# EAGLE design prototype (EAGLE 5.11)
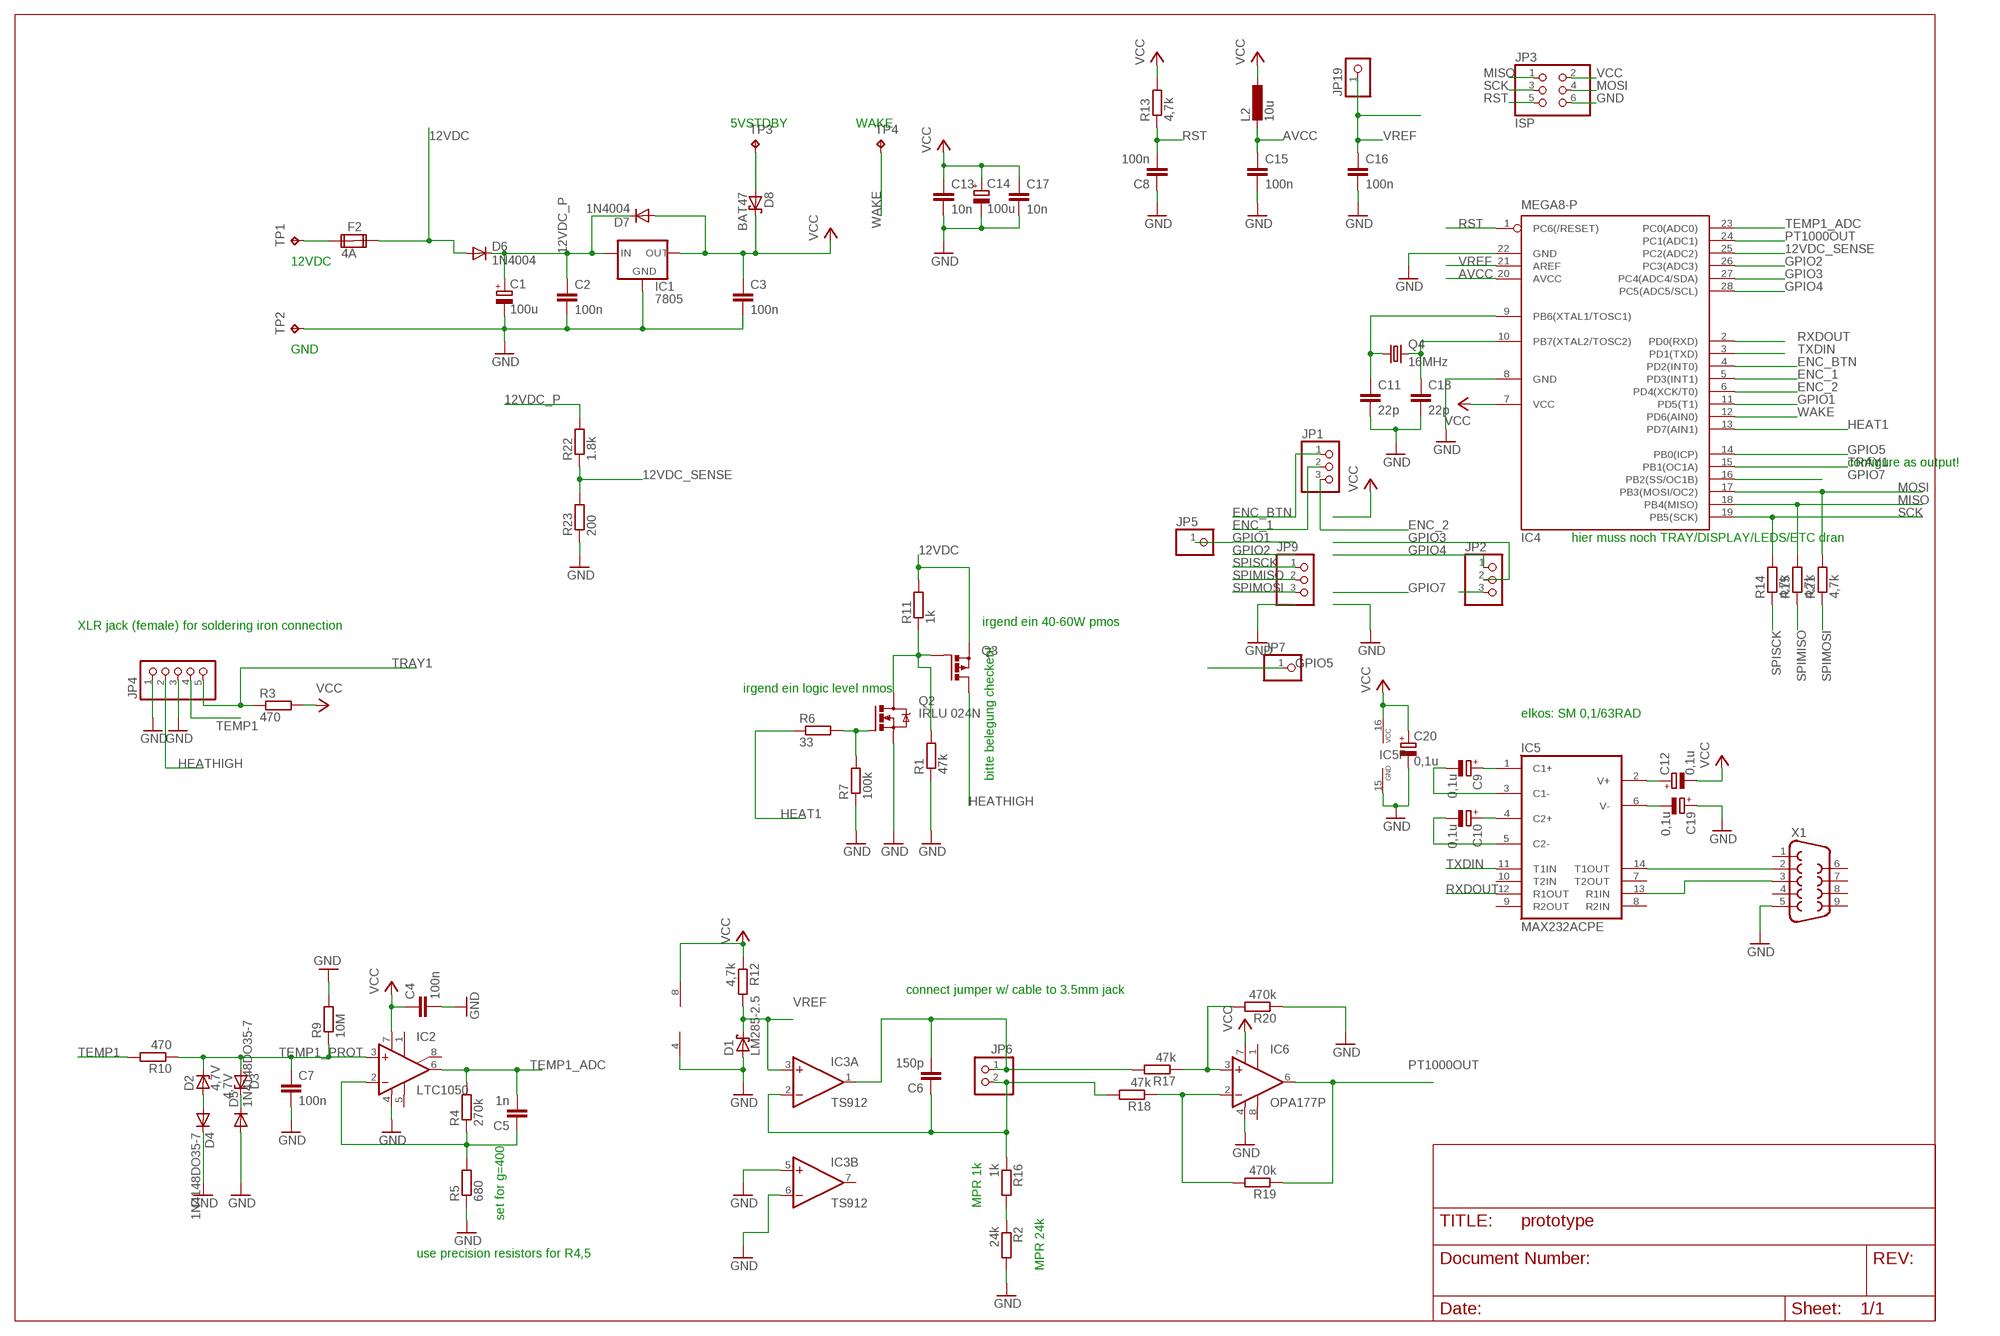
[diagram p0: schematic, sheet 1]

## Parts
C1  100u  CPOL-EUE3.5-8  [E3,5-8]
C2  100n  C-EU050-030X075  [C050-030X075]
C3  100n  C-EU050-030X075  [C050-030X075]
C4  100n  C-EU050-030X075  [C050-030X075]
C5  1n  C-EU050-030X075  [C050-030X075]
C6  150p  C-EU050-025X075  [C050-025X075]
C7  100n  C-EU050-030X075  [C050-030X075]
C8  100n  C-EU050-030X075  [C050-030X075]
C9  0,1u  CPOL-EUE1.8-4  [E1,8-4]
C10  0,1u  CPOL-EUE1.8-4  [E1,8-4]
C11  22p  C-EU025-025X050  [C025-025X050]
C12  0,1u  CPOL-EUE1.8-4  [E1,8-4]
C13  10n  C-EU050-030X075  [C050-030X075]
C14  100u  CPOL-EUE3.5-8  [E3,5-8]
C15  100n  C-EU050-030X075  [C050-030X075]
C16  100n  C-EU050-030X075  [C050-030X075]
C17  10n  C-EU050-030X075  [C050-030X075]
C18  22p  C-EU025-025X050  [C025-025X050]
C19  0,1u  CPOL-EUE1.8-4  [E1,8-4]
C20  0,1u  CPOL-EUE1.8-4  [E1,8-4]
D1  LM285-2.5  SCHOTTKY-DIODETO92H  [TO92H]
D2  4,7V  ZENER-DIODEDO34-7  [DO34Z7]
D3  4,7V  ZENER-DIODEDO34-7  [DO34Z7]
D4  1N4148DO35-7  [DO35-7]
D5  1N4148DO35-7  [DO35-7]
D6  1N4004  [DO41-10]
D7  1N4004  [DO41-10]
D8  BAT47  BAT49  [DO41-10]
F2  4A  FUSE2P  [FUSE1]
IC1  7805  78XXS  [78XXS]
IC2  LTC1050  LM101N  [DIL08]
IC3  TS912  LM358N  [DIL08]
IC4  MEGA8-P  [DIL28-3]
IC5  MAX232ACPE  MAX232  [DIL16]
IC6  OPA177P  [DIL08]
JP1  PINHD-1X3  [1X03]
JP2  PINHD-1X3  [1X03]
JP3  ISP  PINHD-2X3  [2X03]
JP4  PINHD-1X5  [1X05]
JP5  PINHD-1X1  [1X01]
JP6  PINHD-1X2  [1X02]
JP7  PINHD-1X1  [1X01]
JP9  PINHD-1X3  [1X03]
JP19  PINHD1-NOPLACE  [1X1-NOPLACE]
L2  10u  L-EU0207/12  [0207/12]
Q2  IRLU 024N  IRLZ44Z  [TO220BH]
Q3  PMOSFET_PTO220BH  [TO220BH]
Q4  16MHz  CRYSTALHC49S  [HC49/S]
R1  47k  R-EU_0309/10  [0309/10]
R2  24k  R-EU_0309/10  [0309/10]
R3  470  R-EU_0207/7  [0207/7]
R4  270k  R-EU_0309/10  [0309/10]
R5  680  R-EU_0309/10  [0309/10]
R6  33  R-EU_0309/10  [0309/10]
R7  100k  R-EU_0309/10  [0309/10]
R9  10M  R-EU_0309/10  [0309/10]
R10  470  R-EU_0309/10  [0309/10]
R11  1k  R-EU_0309/10  [0309/10]
R12  4,7k  R-EU_0309/10  [0309/10]
R13  4,7k  R-EU_0309/10  [0309/10]
R14  4,7k  R-EU_0309/10  [0309/10]
R15  4,7k  R-EU_0309/10  [0309/10]
R16  1k  R-EU_0309/10  [0309/10]
R17  47k  R-EU_0309/10  [0309/10]
R18  47k  R-EU_0309/10  [0309/10]
R19  470k  R-EU_0309/10  [0309/10]
R20  470k  R-EU_0309/10  [0309/10]
R21  4,7k  R-EU_0309/10  [0309/10]
R22  1.8k  R-EU_0309/10  [0309/10]
R23  200  R-EU_0309/10  [0309/10]
TP1  TPPAD1-13Y  [P1-13Y]
TP2  TPPAD1-13Y  [P1-13Y]
TP3  TPPAD1-13Y  [P1-13Y]
TP4  TPPAD1-13Y  [P1-13Y]
X1  F09HP  [F09HP]

## Nets
12VDC: D6.A F2.2A Q3.S R11.2
12VDC_P: C1.+ C2.1 D6.C D7.C IC1.IN R22.2
12VDC_SENSE: IC4.25(PC2(ADC2)) R22.1 R23.2
AVCC: C15.1 IC4.20(AVCC) L2.2
ENC_1: IC4.5(PD3(INT1)) JP1.2
ENC_2: IC4.6(PD4(XCK/T0)) JP1.3
ENC_BTN: IC4.4(PD2(INT0)) JP1.1
GND: C1.- C2.2 C3.2 C4.2 C7.2 C8.1 C11.2 C13.2 C14.- C15.2 C16.2 C17.2 C18.2 C19.+ C20.- D1.1(A) D4.C D5.A IC1.GND IC2.4(V-) IC3.4(P:V-) IC3.5(B:+IN) IC3.6(B:-IN) IC4.8(GND) IC4.22(GND) IC5.15(GND) IC6.4(V-) JP3.6 JP4.1 JP4.3 Q2.S R1.1 R2.2 R5.1 R7.1 R9.2 R20.1 R23.1 TP2.TP X1.5
GPIO1: IC4.11(PD5(T1)) JP5.1
GPIO2: IC4.26(PC3(ADC3)) JP2.3
GPIO3: IC4.27(PC4(ADC4/SDA)) JP2.2
GPIO4: IC4.28(PC5(ADC5/SCL)) JP2.1
GPIO5: IC4.14(PB0(ICP)) JP7.1
GPIO7: IC4.16(PB2(SS/OC1B))
HEAT1: IC4.13(PD7(AIN1)) R6.1
HEATHIGH: JP4.2 Q3.D
MISO: IC4.18(PB4(MISO)) JP3.1 R15.2
MOSI: IC4.17(PB3(MOSI/OC2)) JP3.4 R21.2
N$1: Q2.G R6.2 R7.2
N$2: Q2.D Q3.G R1.2 R11.1
N$4: C6.2 IC3.1(A:OUT) JP6.1 R17.2
N$5: R2.1 R16.2
N$6: D2.A D4.A
N$7: IC6.3(+IN) R17.1 R20.2
N$8: IC6.2(-IN) R18.1 R19.2
N$9: IC5.14(T1OUT) X1.2
N$10: IC5.13(R1IN) X1.3
N$11: F2.1A TP1.TP
N$12: C6.1 IC3.2(A:-IN) JP6.2 R16.1 R18.2
N$13: D3.C D5.C
N$14: D8.A TP3.TP
N$15: C5.1 IC2.2(-IN) R4.1 R5.2
N$17: C18.1 IC4.10(PB7(XTAL2/TOSC2)) Q4.2
N$18: C9.+ IC5.1(C1+)
N$19: C11.1 IC4.9(PB6(XTAL1/TOSC1)) Q4.1
N$20: C9.- IC5.3(C1-)
N$21: C10.+ IC5.4(C2+)
N$22: C10.- IC5.5(C2-)
N$23: C19.- IC5.6(V-)
N$25: C12.+ IC5.2(V+)
PT1000OUT: IC4.24(PC1(ADC1)) IC6.6(OUT) R19.1
RST: C8.2 IC4.1(PC6(/RESET)) JP3.5 R13.1
RXDOUT: IC4.2(PD0(RXD)) IC5.12(R1OUT)
SCK: IC4.19(PB5(SCK)) JP3.3 R14.2
SPIMISO: JP9.2 R15.1
SPIMOSI: JP9.3 R21.1
SPISCK: JP9.1 R14.1
TEMP1: JP4.4 R10.2
TEMP1_ADC: C5.2 IC2.6(OUT) IC4.23(PC0(ADC0)) R4.2
TEMP1_PROT: C7.1 D2.C D3.A IC2.3(+IN) R9.1 R10.1
TRAY1: IC4.15(PB1(OC1A)) JP4.5 R3.1
TXDIN: IC4.3(PD1(TXD)) IC5.11(T1IN)
VCC: C3.1 C4.1 C12.- C13.1 C14.+ C17.1 C20.+ D7.A D8.C IC1.OUT IC2.7(V+) IC3.8(P:V+) IC4.7(VCC) IC5.16(VCC) IC6.7(V+) JP3.2 L2.1 R3.2 R12.1 R13.2
VREF: C16.1 D1.2(C) IC3.3(A:+IN) IC4.21(AREF) JP19.1 R12.2
WAKE: IC4.12(PD6(AIN0)) TP4.TP
Unconnected: F2.1B F2.2B IC2.1(ON1) IC2.5(OPT) IC2.8(ON2) IC3.7(B:OUT) IC5.7(T2OUT) IC5.8(R2IN) IC5.9(R2OUT) IC5.10(T2IN) IC6.1(TRIM1) IC6.8(TRIM2) X1.1 X1.4 X1.6 X1.7 X1.8 X1.9

## Notes on the sheet
- 5VSTDBY | WAKE
- 12VDC
- GND
- configure as output!
- hier muss noch TRAY/DISPLAY/LEDS/ETC dran
- irgend ein 40-60W pmos
- XLR jack (female) for soldering iron connection
- irgend ein logic level nmos
- elkos: SM 0,1/63RAD
- bitte belegung checken!
- connect jumper w/ cable to 3.5mm jack
- MPR 1k
- set for g=400
- use precision resistors for R4,5
- MPR 24k

## Library data of the parts
C1 C14 = rcl:CPOL-EU: POLARIZED CAPACITOR, European symbol
C2-C5 C7 C8 C11 C13 C15-C18 = resistor:C-EU: CAPACITOR, European symbol
C6 = rcl:C-EU: CAPACITOR, European symbol
C9 C10 C12 C19 C20 = resistor:CPOL-EU: POLARIZED CAPACITOR, European symbol
D1 = diode:SCHOTTKY-DIODE: Schottky Diode
D2 D3 = diode:ZENER-DIODE: Z-Diode
D4 D5 = diode:1N4148: DIODE high speed (Philips)
D6 D7 = diode:1N4004: DIODE general purpose rectifier, 1 A
D8 = diode:BAT49: DIODE small signal diode
F2 = special:FUSE2P: FUSE 5 x 20 mm
IC1 = v-reg:78XXS: VOLTAGE REGULATOR
IC2 = linear:LM101: OP AMP
IC3 = linear:LM358: OP AMP also LM158; LM258; LM2904 Source: http://cache.national.com/ds/LM/LM158.pdf
IC4 = atmel:MEGA8-P: MICROCONTROLLER 8 Kbytes FLASH, 1 kbytes SRAM, 512 bytes EEPROM, USART, 4-channel 10 bit ADC, 2-channel 8 bit ADC Pin compatible with Atmega48, ATMega88, ATMega168 Source: avr.lbr; OC_FARNELL: unknown; OC_NEWARK: unknown
IC5 = maxim:MAX232: RS232 TRANSEIVER; MF: MAXIM; MPN: MAX232ACPE+; OC_FARNELL: 9723773; OC_NEWARK: 68K4544
IC6 = burr-brown:OPA177: Precision Operational Amplifier; MPN: OPA177GPG4; OC_FARNELL: 1219410; OC_NEWARK: 05M0933
JP1 JP2 JP9 = pinhead:PINHD-1X3: PIN HEADER
JP3 = pinhead:PINHD-2X3: PIN HEADER
JP4 = pinhead:PINHD-1X5: PIN HEADER
JP5 JP7 = pinhead:PINHD-1X1: PIN HEADER
JP6 = pinhead:PINHD-1X2: PIN HEADER
JP19 = custom:PINHD1-NOPLACE
L2 = resistor:L-EU: INDUCTOR, European symbol
Q2 = transistor-power:IRLZ44Z: N-Channel HEXFET® Power MOSFET Logic Level AUTOMOTIVE MOSFET Source: http://www.irf.com/product-info/datasheets/data/irlz44zpbf.pdf
Q3 = transistor-power:PMOSFET_P: Power MOSFET P-Channel
Q4 = crystal:CRYSTAL: CRYSTAL; OC_FARNELL: 1667008; OC_NEWARK: unknown
R1 R2 R4-R7 R9-R23 = resistor:R-EU_: RESISTOR, European symbol
R3 = rcl:R-EU_: RESISTOR, European symbol
TP1-TP4 = testpad:TP: Test pad
X1 = con-subd:F09: SUB-D; OC_FARNELL: unknown; OC_NEWARK: unknown

## Board
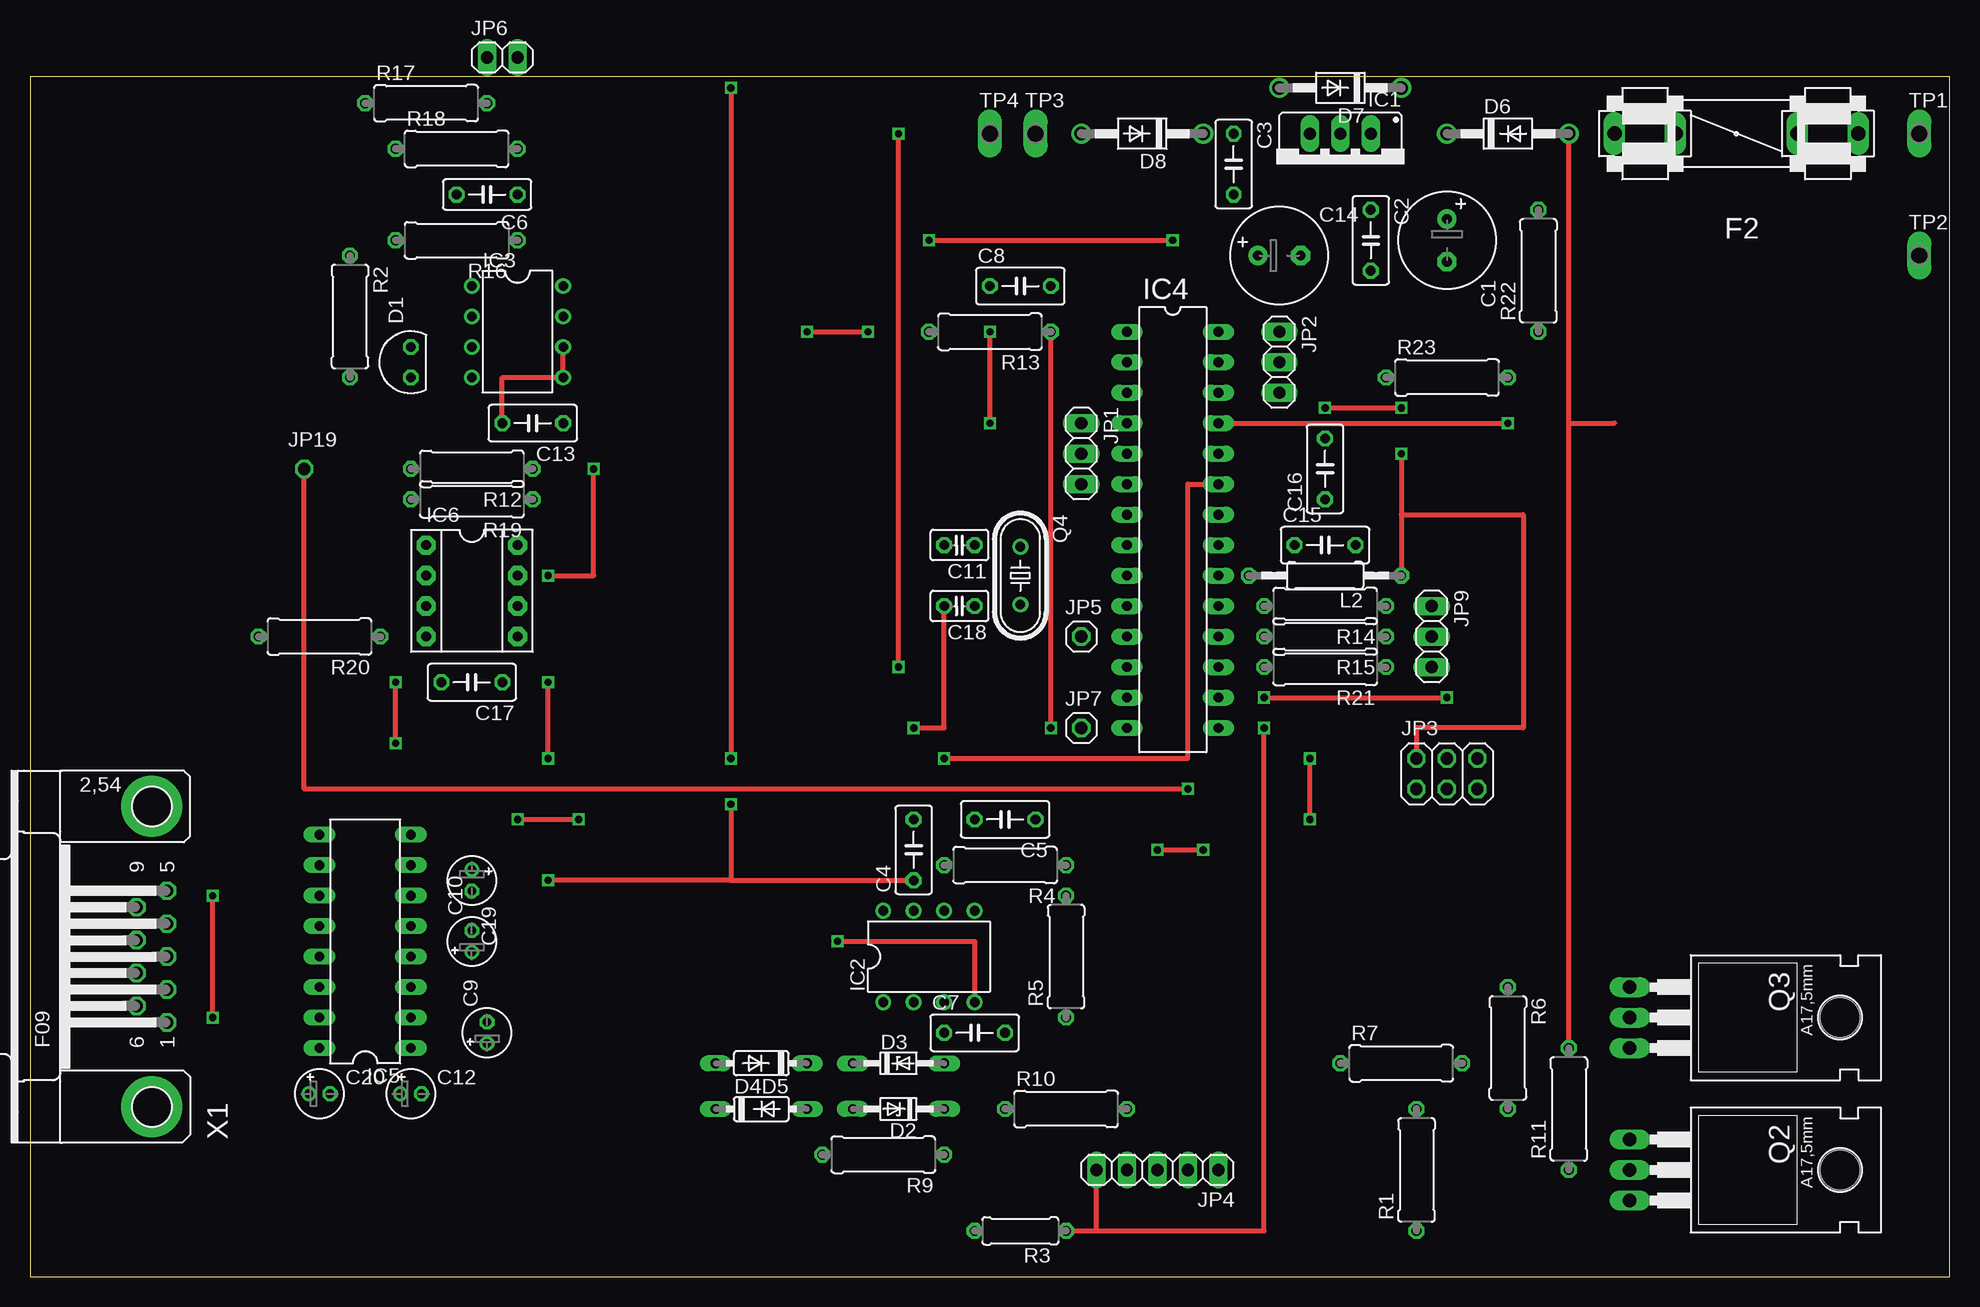
[diagram p1: board, top side]
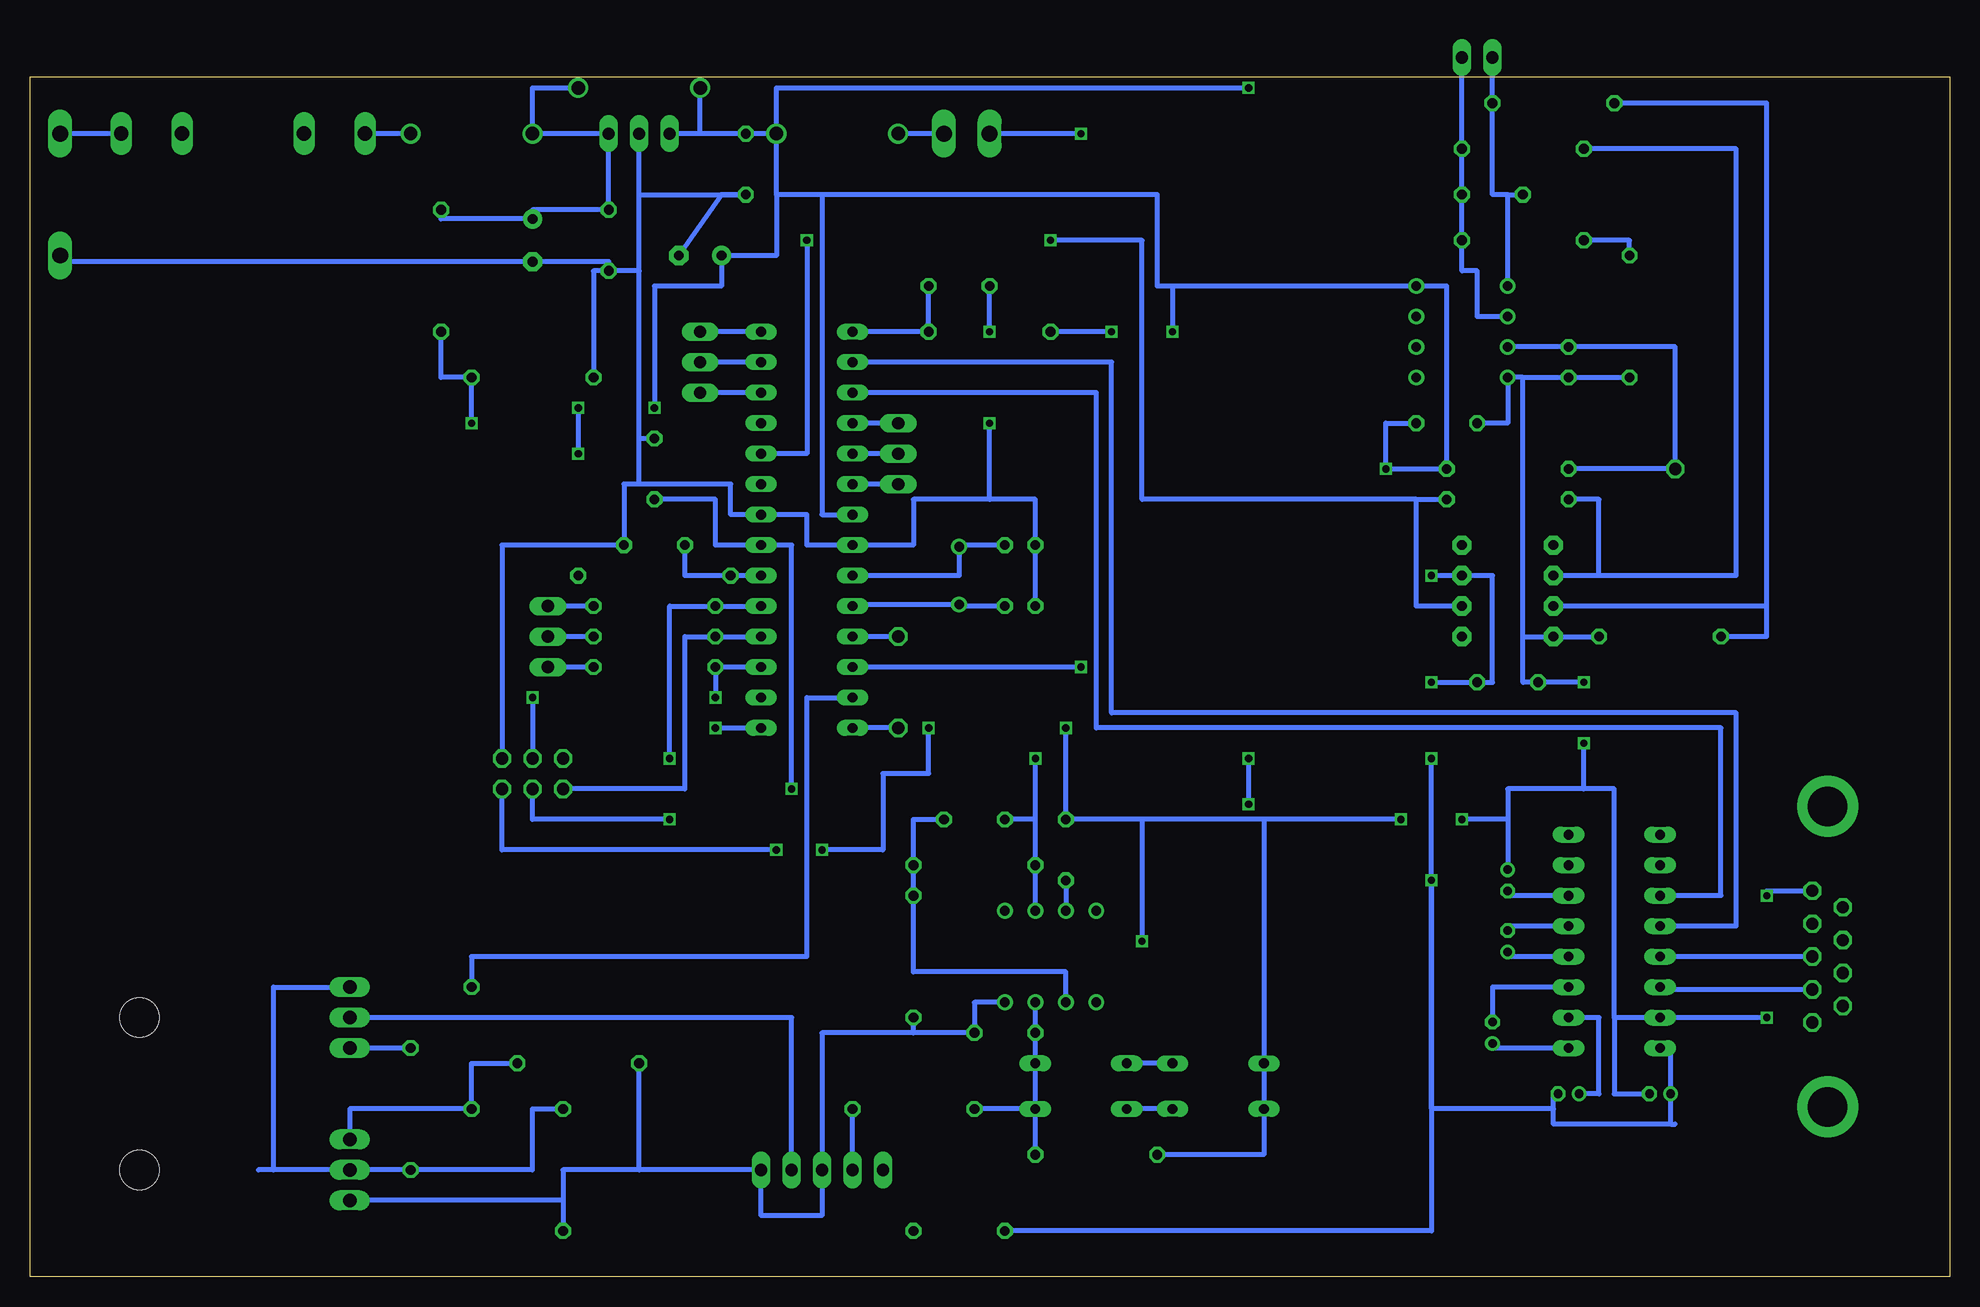
[diagram p2: board, bottom side, seen from below]

Size 160 x 100 mm. Coordinates in mm from the lower left corner, seen from the top.
Outline: 0,0 160,0 160,100 0,100 0,0
Copper layers (1*16): Top 0.035mm / dielectric 1.5mm / Bottom 0.035mm
Design rules "default": minimum track width 10mil, minimum drill 24mil, track to track 8mil, track to pad 8mil, pad to pad 8mil, via to via 8mil, smd to smd 8mil, copper to edge 40mil, drill to drill 8mil, minimum pad ring 10mil, minimum via ring 8mil, stop-mask expansion 4mil, vias tented up to drill 0mil, thermal gap 10mil

### Footprints (pad centres in the part's own frame; a part is rotated, then mirrored left to right if it is on the bottom)
E3,5-8 = drill 0.813 pad 1.6 round: + -1.778,0 | drill 0.813 pad 1.6 octagon: - 1.778,0
C050-030X075 = drill 0.813 octagon: 1 -2.54,0; 2 2.54,0
C050-025X075 = drill 0.813 octagon: 1 -2.54,0; 2 2.54,0
E1,8-4 = drill 0.711 pad 1.168 round: + -0.889,0 | drill 0.711 pad 1.168 octagon: - 0.889,0
C025-025X050 = drill 0.813 octagon: 1 -1.27,0; 2 1.27,0
TO92H = drill 0.813 octagon: 1 -1.27,0; 2 1.27,0
DO34Z7 = drill 0.813 long: A 3.81,0; C -3.81,0
DO35-7 = drill 0.813 long: A 3.81,0; C -3.81,0
DO41-10 = drill 1.118 round: A 5.08,0; C -5.08,0
FUSE1 = drill 1.194 long: 1A -10.16,0; 1B -5.08,0; 2A 10.16,0; 2B 5.08,0
78XXS = drill 1.016 long: GND 0,-2.54; IN -2.54,-2.54; OUT 2.54,-2.54
DIL08 = drill 0.813 pad 1.27 round: 1 -3.81,-3.81; 2 -1.27,-3.81; 3 1.27,-3.81; 4 3.81,-3.81; 5 3.81,3.81; 6 1.27,3.81; 7 -1.27,3.81; 8 -3.81,3.81
DIL28-3 = drill 0.813 long: 1 -16.51,-3.81; 2 -13.97,-3.81; 3 -11.43,-3.81; 4 -8.89,-3.81; 5 -6.35,-3.81; 6 -3.81,-3.81; 7 -1.27,-3.81; 8 1.27,-3.81; 9 3.81,-3.81; 10 6.35,-3.81; 11 8.89,-3.81; 12 11.43,-3.81; 13 13.97,-3.81; 14 16.51,-3.81; 15 16.51,3.81; 16 13.97,3.81; 17 11.43,3.81; 18 8.89,3.81; 19 6.35,3.81; 20 3.81,3.81; 21 1.27,3.81; 22 -1.27,3.81; 23 -3.81,3.81; 24 -6.35,3.81; 25 -8.89,3.81; 26 -11.43,3.81; 27 -13.97,3.81; 28 -16.51,3.81
DIL16 = drill 0.813 long: 1 -8.89,-3.81; 2 -6.35,-3.81; 3 -3.81,-3.81; 4 -1.27,-3.81; 5 1.27,-3.81; 6 3.81,-3.81; 7 6.35,-3.81; 8 8.89,-3.81; 9 8.89,3.81; 10 6.35,3.81; 11 3.81,3.81; 12 1.27,3.81; 13 -1.27,3.81; 14 -3.81,3.81; 15 -6.35,3.81; 16 -8.89,3.81
DIL08' = drill 0.813 pad 1.6 octagon: 1 -3.81,-3.81; 2 -1.27,-3.81; 3 1.27,-3.81; 4 3.81,-3.81; 5 3.81,3.81; 6 1.27,3.81; 7 -1.27,3.81; 8 -3.81,3.81
1X03 = drill 1.016 long: 1 -2.54,0; 2 0,0; 3 2.54,0
2X03 = drill 1.016 octagon: 1 -2.54,-1.27; 2 -2.54,1.27; 3 0,-1.27; 4 0,1.27; 5 2.54,-1.27; 6 2.54,1.27
1X05 = drill 1.016 long: 1 -5.08,0; 2 -2.54,0; 3 0,0; 4 2.54,0; 5 5.08,0
1X01 = drill 1.016 octagon: 1 0,0
1X02 = drill 1.016 long: 1 -1.27,0; 2 1.27,0
1X1-NOPLACE = drill 1.016 octagon: 1 0,0
0207/12 = drill 0.813 octagon: 1 -6.35,0; 2 6.35,0
TO220BH = drill 1.118 long: D 0,-6.35; G -2.54,-6.35; S 2.54,-6.35 | hole 3.302: 0,11.176
HC49/S = drill 0.813 round: 1 -2.413,0; 2 2.413,0
0309/10 = drill 0.813 octagon: 1 -5.08,0; 2 5.08,0
0207/7 = drill 0.813 octagon: 1 -3.81,0; 2 3.81,0
P1-13Y = drill 1.321 pad 1.905 long: TP 0,0
F09HP = drill 1.016 octagon: 1 -5.486,-1.27; 2 -2.743,-1.27; 3 0,-1.27; 4 2.743,-1.27; 5 5.486,-1.27; 6 -4.115,1.27; 7 -1.372,1.27; 8 1.372,1.27; 9 4.115,1.27 | drill 3.302 pad 5.08 round: G1 -12.522,0; G2 12.522,0

### Placement (x,y rotation side)
C1  118.11,86.36 270 top
C2  111.76,86.36 270 top
C3  100.33,92.71 270 top
C4  73.66,35.56 90 top
C5  81.28,38.1 180 top
C6  38.1,90.17 180 top
C7  78.74,20.32 0 top
C8  82.55,82.55 0 top
C9  38.1,20.32 90 top
C10  36.83,27.94 90 top
C11  77.47,60.96 180 top
C12  31.75,15.24 0 top
C13  41.91,71.12 180 top
C14  104.14,85.09 0 top
C15  107.95,60.96 0 top
C16  107.95,67.31 90 top
C17  36.83,49.53 180 top
C18  77.47,55.88 180 top
C19  36.83,33.02 270 top
C20  24.13,15.24 0 top
D1  31.75,76.2 90 top
D2  72.39,13.97 180 top
D3  72.39,17.78 0 top
D4  60.96,13.97 0 top
D5  60.96,17.78 180 top
D6  123.19,95.25 0 top
D7  109.22,99.06 180 top
D8  92.71,95.25 180 top
F2  142.24,95.25 180 top
IC1  109.22,92.71 180 top
IC2  74.93,26.67 0 top
IC3  40.64,78.74 270 top
IC4  95.25,62.23 270 top
IC5  27.94,27.94 90 top
IC6  OPA177P  [DIL08']  36.83,57.15 270 top
JP1  87.63,68.58 270 top
JP2  104.14,76.2 270 top
JP3  118.11,41.91 0 top
JP4  93.98,8.89 180 top
JP5  87.63,53.34 0 top
JP6  39.37,101.6 0 top
JP7  87.63,45.72 0 top
JP9  116.84,53.34 270 top
JP19  22.86,67.31 0 top
L2  107.95,58.42 180 top
Q2  139.7,8.89 270 top
Q3  139.7,21.59 270 top
Q4  82.55,58.42 270 top
R1  115.57,8.89 90 top
R2  26.67,80.01 270 top
R3  82.55,3.81 180 top
R4  81.28,34.29 180 top
R5  86.36,26.67 90 top
R6  123.19,19.05 270 top
R7  114.3,17.78 0 top
R9  71.12,10.16 180 top
R10  86.36,13.97 0 top
R11  128.27,13.97 90 top
R12  36.83,67.31 180 top
R13  80.01,78.74 180 top
R14  107.95,55.88 180 top
R15  107.95,53.34 180 top
R16  35.56,86.36 180 top
R17  33.02,97.79 0 top
R18  35.56,93.98 0 top
R19  36.83,64.77 180 top
R20  24.13,53.34 180 top
R21  107.95,50.8 180 top
R22  125.73,83.82 90 top
R23  118.11,74.93 0 top
TP1  157.48,95.25 0 top
TP2  157.48,85.09 0 top
TP3  83.82,95.25 0 top
TP4  80.01,95.25 0 top
X1  10.16,26.67 90 top

### Tracks (layer width: path | path; a pad name or v marks a point on that pad's centre or on a via)
12VDC
  Top 0.406: 128.27,71.12 D6.A | 128.27,71.12 132.08,71.12 | R11.2 128.27,71.12
  Bottom 0.406: D6.A F2.2A | R11.2 Q3.S
12VDC_P
  Bottom 0.406: D7.C 118.11,99.06 D6.C IC1.IN C2.1 118.11,88.9 C1.+ 125.73,88.14 R22.2
12VDC_SENSE  (via drill 0.6)
  Top 0.406: IC4.25 v123.19,71.12
  Bottom 0.406: R22.1 125.73,74.93 R23.2 v123.19,71.12
AVCC
  Bottom 0.406: IC4.20 L2.2 105.41,58.42 C15.1
ENC_1
  Bottom 0.406: JP1.2 IC4.5
ENC_2
  Bottom 0.406: JP1.3 IC4.6
ENC_BTN
  Bottom 0.406: JP1.1 IC4.4
GND  (via drill 0.6)
  Top 0.406: v15.24,21.59 v15.24,31.75 | v30.48,44.45 v30.48,49.53 | v40.64,38.1 v45.72,38.1 | v80.01,71.12 v80.01,78.74 | C18.2 76.2,45.72 v73.66,45.72 | IC2.4 78.74,27.94 v67.31,27.94 | IC3.6 IC3.5 39.37,74.93 C13.2
  Bottom 0.406: C20.- 27.94,15.24 27.94,21.59 | 27.94,21.59 27.94,40.64 30.48,40.64 | 30.48,40.64 36.83,40.64 36.83,38.1 | 36.83,38.1 C19.+ | 27.94,21.59 IC5.15 v15.24,21.59 | C18.2 C11.2 76.2,64.77 80.01,64.77 | 80.01,64.77 86.36,64.77 86.36,60.96 IC4.8 95.25,60.96 95.25,63.5 IC4.22 101.6,63.5 101.6,66.04 109.22,66.04 | 109.22,66.04 109.22,69.85 | 109.22,69.85 109.22,83.82 | 109.22,83.82 109.22,90.17 | 109.22,90.17 IC1.GND | 109.22,90.17 C3.2 102.36,90.17 C14.- | TP2.TP 157.48,84.58 C1.- 111.76,84.58 C2.2 | 109.22,83.82 C2.2 | R23.1 113.03,83.82 C2.2 | IC2.4 81.28,22.86 C7.2 86.36,20.32 | 86.36,20.32 93.98,20.32 JP4.3 93.98,5.08 99.06,5.08 JP4.1 109.22,8.89 | R9.2 57.15,10.16 D4.C D5.A 57.15,38.1 | 86.36,20.32 R5.1 | 35.56,74.93 IC3.4 36.83,71.12 C13.2 | R2.2 D1.1 35.56,74.93 | 35.56,53.34 35.56,74.93 | 35.56,53.34 IC6.4 R20.1 | 109.22,69.85 C16.2 | 109.22,66.04 110.49,66.04 C15.2 120.65,60.96 JP3.6 | X1.5 15.24,32.16 v15.24,31.75 | 115.57,6.35 Q2.S | 115.57,6.35 R1.1 | 109.22,8.89 115.57,8.89 115.57,6.35 | 109.22,8.89 R7.1 | 35.56,53.34 35.56,49.53 C17.2 v30.48,49.53 | 30.48,40.64 v30.48,44.45 | 57.15,38.1 67.31,38.1 | 67.31,38.1 C4.2 v73.66,45.72 | v45.72,38.1 57.15,38.1 | 36.83,38.1 v40.64,38.1 | 80.01,64.77 v80.01,71.12 | v80.01,78.74 C8.1 | 67.31,38.1 v67.31,27.94
GPIO1
  Bottom 0.406: JP5.1 IC4.11
GPIO2
  Bottom 0.406: IC4.26 JP2.3
GPIO3
  Bottom 0.406: IC4.27 JP2.2
GPIO4
  Bottom 0.406: IC4.28 JP2.1
GPIO5
  Bottom 0.406: JP7.1 IC4.14
HEAT1
  Bottom 0.406: IC4.13 95.25,48.26 95.25,26.67 123.19,26.67 R6.1
HEATHIGH
  Bottom 0.406: Q3.D 96.52,21.59 JP4.2
MISO
  Bottom 0.406: IC4.18 R15.2 105.41,53.34 105.41,40.64 JP3.1
MOSI  (via drill 0.6)
  Top 0.406: v102.87,48.26 v118.11,48.26
  Bottom 0.406: IC4.17 R21.2 v102.87,48.26 | v118.11,48.26 JP3.4
N$1
  Bottom 0.406: Q2.G 133.35,13.97 R6.2 123.19,17.78 R7.2
N$2
  Bottom 0.406: Q3.G 139.7,24.13 139.7,8.89 | 139.7,8.89 140.97,8.89 | 139.7,8.89 Q2.D R11.1 118.11,8.89 118.11,13.97 R1.2
N$4
  Bottom 0.406: IC3.1 36.83,90.17 | 36.83,90.17 C6.2 | 36.83,90.17 38.1,90.17 R17.2 JP6.1
N$5
  Bottom 0.406: R16.2 26.67,86.36 R2.1
N$6
  Bottom 0.406: D4.A D2.A
N$7
  Bottom 0.406: R17.1 15.24,97.79 15.24,55.88 | 15.24,55.88 IC6.3 | R20.2 15.24,53.34 15.24,55.88
N$8
  Bottom 0.406: R18.1 17.78,93.98 17.78,58.42 29.21,58.42 | 29.21,58.42 IC6.2 | R19.2 29.21,64.77 29.21,58.42
N$9
  Bottom 0.406: IC5.14 24.13,23.93 X1.2
N$10
  Bottom 0.406: X1.3 IC5.13
N$11
  Bottom 0.406: F2.1A TP1.TP
N$12
  Bottom 0.406: IC3.2 39.37,80.01 39.37,83.82 40.64,83.82 R16.1 C6.1 R18.2 JP6.2
N$13
  Bottom 0.406: D5.C D3.C
N$14
  Bottom 0.406: TP3.TP D8.A
N$15
  Bottom 0.406: IC2.2 73.66,25.4 86.36,25.4 R5.2 R4.1 86.36,38.1 C5.1
N$17
  Bottom 0.406: IC4.10 91.44,56.01 Q4.2 82.55,55.88 C18.1
N$18
  Bottom 0.406: IC5.1 38.1,19.05 C9.+
N$19
  Bottom 0.406: IC4.9 82.55,58.42 Q4.1 82.55,60.96 C11.1
N$20
  Bottom 0.406: C9.- 38.1,24.13 IC5.3
N$21
  Bottom 0.406: IC5.4 36.83,26.67 C10.+
N$22
  Bottom 0.406: IC5.5 36.83,29.21 C10.-
N$23
  Bottom 0.406: IC5.6 36.83,31.75 C19.-
N$25
  Bottom 0.406: IC5.2 29.21,21.59 29.21,15.24 C12.+
PT1000OUT  (via drill 0.6)
  Top 0.406: v74.93,86.36 v95.25,86.36
  Bottom 0.406: 44.45,64.77 R19.1 | 44.45,64.77 44.45,55.88 IC6.6 | IC4.24 95.25,68.58 v95.25,86.36 | v74.93,86.36 67.31,86.36 67.31,64.77 44.45,64.77
RST  (via drill 0.6)
  Top 0.406: v93.98,35.56 v97.79,35.56 | v85.09,45.72 R13.1
  Bottom 0.406: IC4.1 R13.1 C8.2 | JP3.5 120.65,35.56 v97.79,35.56 | v93.98,35.56 88.9,35.56 88.9,41.91 85.09,41.91 v85.09,45.72
RXDOUT
  Bottom 0.406: IC4.2 69.85,76.2 69.85,46.99 17.78,46.99 17.78,29.21 IC5.12
SCK  (via drill 0.6)
  Top 0.406: v106.68,38.1 v106.68,43.18
  Bottom 0.406: IC4.19 R14.2 106.68,55.88 v106.68,43.18 | v106.68,38.1 118.11,38.1 JP3.3
SPIMISO
  Bottom 0.406: R15.1 JP9.2
SPIMOSI
  Bottom 0.406: R21.1 JP9.3
SPISCK
  Bottom 0.406: R14.1 JP9.1
TEMP1
  Bottom 0.406: JP4.4 R10.2
TEMP1_ADC  (via drill 0.6)
  Top 0.406: v76.2,43.18 96.52,43.18 96.52,66.04 IC4.23
  Bottom 0.406: 76.2,38.1 R4.2 IC2.6 | 76.2,38.1 v76.2,43.18 | 76.2,38.1 C5.2
TEMP1_PROT
  Bottom 0.406: D2.C R10.1 | D2.C D3.A C7.1 IC2.3 | R9.1 D2.C
TRAY1  (via drill 0.6)
  Top 0.406: 88.9,3.81 JP4.5 | 88.9,3.81 102.87,3.81 v102.87,45.72 | R3.1 88.9,3.81
  Bottom 0.406: v102.87,45.72 IC4.15
TXDIN
  Bottom 0.406: IC5.11 19.05,31.75 19.05,45.72 71.12,45.72 71.12,73.66 IC4.3
VCC  (via drill 0.6)
  Top 0.406: v43.18,58.42 46.99,58.42 v46.99,67.31 | v64.77,78.74 v69.85,78.74 | v43.18,43.18 v43.18,49.53 | 114.3,63.5 L2.1 | 114.3,63.5 124.46,63.5 124.46,45.72 115.57,45.72 JP3.2 | v114.3,68.58 114.3,63.5 | v107.95,72.39 v114.3,72.39 | 58.42,33.02 v43.18,33.02 | v58.42,99.06 v58.42,43.18 | v58.42,39.37 58.42,33.02 | 58.42,33.02 C4.1
  Bottom 0.406: IC5.16 23.24,19.05 C20.+ 23.24,12.7 | C12.- 33.02,15.24 33.02,13.97 | 33.02,13.97 33.02,12.7 23.24,12.7 | 23.24,12.7 22.86,12.7 | 97.79,90.17 97.79,85.09 C14.+ 102.36,82.55 107.95,82.55 v107.95,72.39 | 97.79,90.17 D8.C | v43.18,58.42 IC6.7 38.1,58.42 38.1,49.53 C17.1 v43.18,49.53 | 64.77,82.55 IC3.8 41.91,82.55 R12.1 v46.99,67.31 46.99,71.12 C13.1 | 64.77,82.55 66.04,82.55 66.04,90.17 93.98,90.17 | 93.98,90.17 97.79,90.17 | v69.85,78.74 R13.2 | 64.77,82.55 v64.77,78.74 | v43.18,43.18 43.18,13.97 33.02,13.97 | IC4.7 93.98,63.5 93.98,90.17 | v114.3,72.39 v114.3,68.58 | 104.14,95.25 C3.1 D8.C | 104.14,95.25 IC1.OUT | 104.14,95.25 D7.A | C4.1 IC2.7 | R3.2 43.18,3.81 v43.18,33.02 43.18,30.48 | v58.42,99.06 97.79,99.06 D8.C | v58.42,43.18 v58.42,39.37
VREF  (via drill 0.6)
  Top 0.406: v96.52,40.64 22.86,40.64 JP19.1
  Bottom 0.406: IC3.3 D1.2 22.86,77.47 JP19.1 R12.2 | C16.1 102.87,64.77 102.87,60.96 IC4.21 96.52,60.96 v96.52,40.64
WAKE  (via drill 0.6)
  Top 0.406: v72.39,50.8 v72.39,95.25
  Bottom 0.406: v72.39,50.8 IC4.12 | v72.39,95.25 TP4.TP